# Altium project DEV Board.PrjPCB
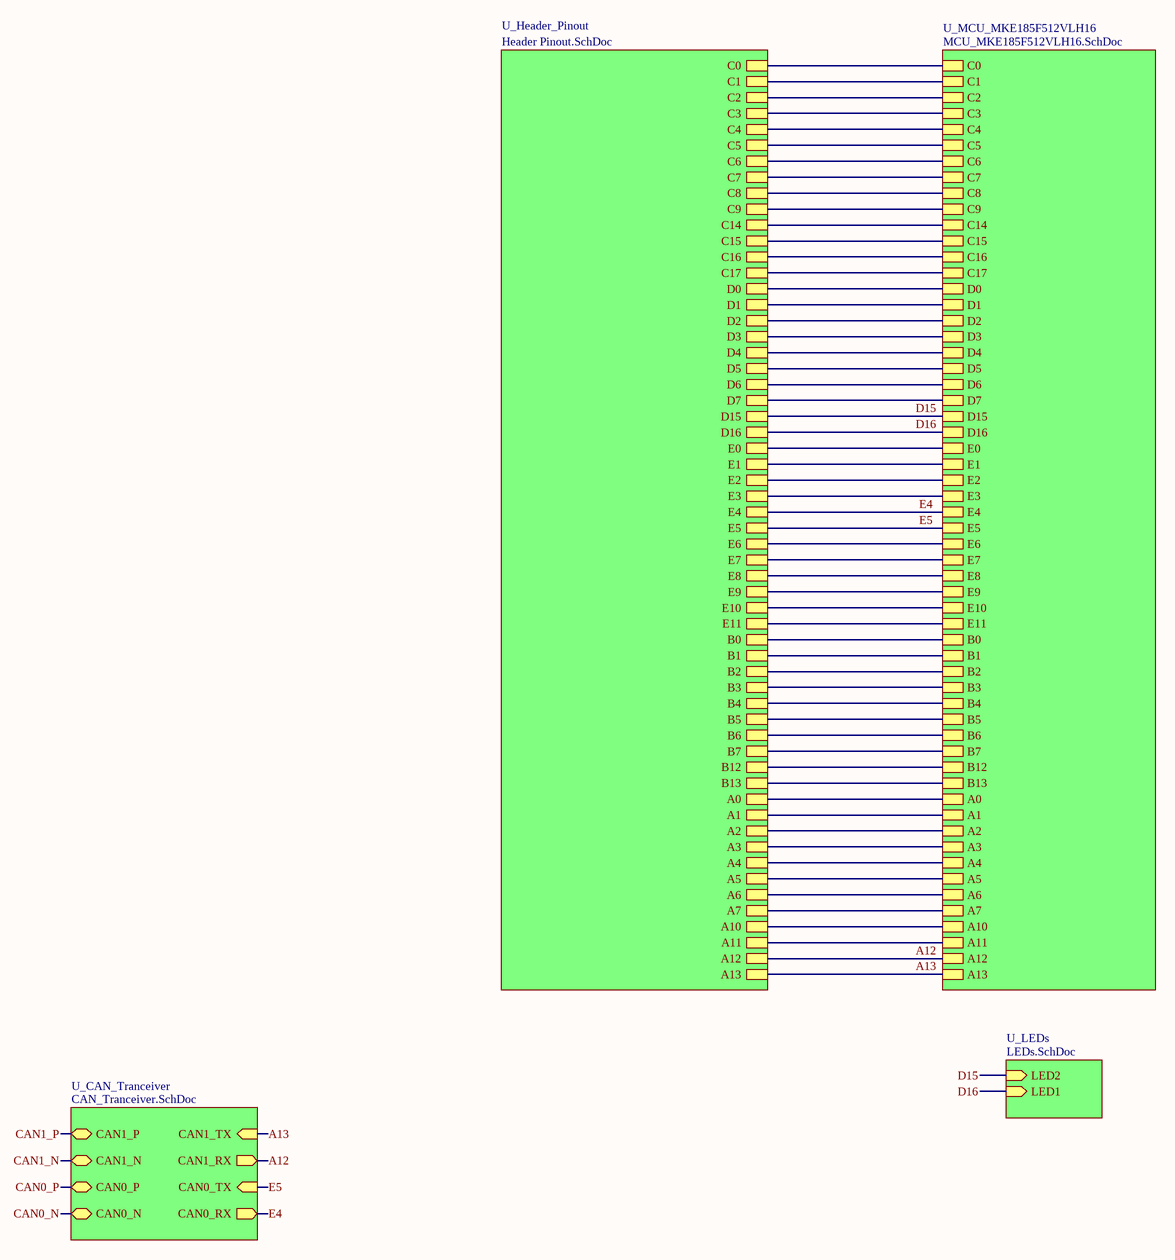
[diagram p0: DEV Board.SchDoc]
5 sheets, 54 parts. Net scope: hierarchical (ports join the sheet entries above them; power ports are global).
Board file: DEV BOARD PCB.PcbDoc
Sheets:
  DEV Board.SchDoc
    U_CAN_Tranceiver = CAN_Tranceiver.SchDoc
    U_LEDs = LEDs.SchDoc
    U_MCU_MKE185F512VLH16 = MCU_MKE185F512VLH16.SchDoc
    U_Header_Pinout = Header Pinout.SchDoc

## Sheet DEV Board.SchDoc
size A3

### Sub-sheets
U_CAN_Tranceiver = CAN_Tranceiver.SchDoc: CAN1_RX (out), CAN1_TX (in), CAN1_P (bidir), CAN1_N (bidir), CAN0_RX (out), CAN0_TX (in), CAN0_P (bidir), CAN0_N (bidir)
U_Header_Pinout = Header Pinout.SchDoc: A13, A12, A11, A10, A7, A6, A5, A4, A3, A2, A1, A0, B13, B12, B7, B6, B5, B4, B3, B2, B1, B0, E11, E10, E9, E8, E7, E6, E5, E4, E3, E2, E1, E0, D16, D15, D7, D6, D5, D4, D3, D2, D1, D0, C17, C16, C15, C14, C9, C8, C7, C6, C5, C4, C3, C2, C1, C0
U_LEDs = LEDs.SchDoc: LED2 (in), LED1 (in)
U_MCU_MKE185F512VLH16 = MCU_MKE185F512VLH16.SchDoc: C0, C1, C2, C3, C6, C7, C8, C9, C14, C15, C16, C17, C4, C5, D0, D1, D2, D3, D4, D5, D6, D7, D15, D16, E0, E1, E2, E3, E4, E5, E6, E7, E8, E9, E10, E11, B0, B1, B2, B3, B4, B5, B6, B7, B12, B13, A4, A5, A10, A0, A1, A2, A3, A6, A7, A11, A12, A13

### Nets
A0: sheet U_MCU_MKE185F512VLH16/A0, sheet U_Header_Pinout/A0
A1: sheet U_MCU_MKE185F512VLH16/A1, sheet U_Header_Pinout/A1
A2: sheet U_MCU_MKE185F512VLH16/A2, sheet U_Header_Pinout/A2
A3: sheet U_MCU_MKE185F512VLH16/A3, sheet U_Header_Pinout/A3
A12: sheet U_CAN_Tranceiver/CAN1_RX, sheet U_MCU_MKE185F512VLH16/A12, sheet U_Header_Pinout/A12
A13: sheet U_CAN_Tranceiver/CAN1_TX, sheet U_MCU_MKE185F512VLH16/A13, sheet U_Header_Pinout/A13
C14: sheet U_MCU_MKE185F512VLH16/C14, sheet U_Header_Pinout/C14
D4: sheet U_MCU_MKE185F512VLH16/D4, sheet U_Header_Pinout/D4
D15: sheet U_LEDs/LED2, sheet U_MCU_MKE185F512VLH16/D15, sheet U_Header_Pinout/D15
D16: sheet U_LEDs/LED1, sheet U_MCU_MKE185F512VLH16/D16, sheet U_Header_Pinout/D16
E4: sheet U_CAN_Tranceiver/CAN0_RX, sheet U_MCU_MKE185F512VLH16/E4, sheet U_Header_Pinout/E4
E5: sheet U_CAN_Tranceiver/CAN0_TX, sheet U_MCU_MKE185F512VLH16/E5, sheet U_Header_Pinout/E5
E11: sheet U_MCU_MKE185F512VLH16/E11, sheet U_Header_Pinout/E11
JTAG_RST: sheet U_MCU_MKE185F512VLH16/A5, sheet U_Header_Pinout/A5
JTAG_TCLK: sheet U_MCU_MKE185F512VLH16/C4, sheet U_Header_Pinout/C4
JTAG_TDI: sheet U_MCU_MKE185F512VLH16/C5, sheet U_Header_Pinout/C5
JTAG_TDO: sheet U_MCU_MKE185F512VLH16/A10, sheet U_Header_Pinout/A10
JTAG_TMS: sheet U_MCU_MKE185F512VLH16/A4, sheet U_Header_Pinout/A4
NetP3_5: sheet U_MCU_MKE185F512VLH16/E10, sheet U_Header_Pinout/E10
NetP3_7: sheet U_MCU_MKE185F512VLH16/D0, sheet U_Header_Pinout/D0
NetP3_8: sheet U_MCU_MKE185F512VLH16/D1, sheet U_Header_Pinout/D1
NetP3_9: sheet U_MCU_MKE185F512VLH16/E9, sheet U_Header_Pinout/E9
NetP3_12: sheet U_MCU_MKE185F512VLH16/E3, sheet U_Header_Pinout/E3
NetP3_13: sheet U_MCU_MKE185F512VLH16/B6, sheet U_Header_Pinout/B6
NetP3_14: sheet U_MCU_MKE185F512VLH16/B7, sheet U_Header_Pinout/B7
NetP4_2: sheet U_MCU_MKE185F512VLH16/E7, sheet U_Header_Pinout/E7
NetP4_3: sheet U_MCU_MKE185F512VLH16/A6, sheet U_Header_Pinout/A6
NetP4_4: sheet U_MCU_MKE185F512VLH16/A7, sheet U_Header_Pinout/A7
NetP4_5: sheet U_MCU_MKE185F512VLH16/C8, sheet U_Header_Pinout/C8
NetP4_6: sheet U_MCU_MKE185F512VLH16/C9, sheet U_Header_Pinout/C9
NetP4_7: sheet U_MCU_MKE185F512VLH16/B0, sheet U_Header_Pinout/B0
NetP4_8: sheet U_MCU_MKE185F512VLH16/B1, sheet U_Header_Pinout/B1
NetP4_11: sheet U_MCU_MKE185F512VLH16/D2, sheet U_Header_Pinout/D2
NetP4_12: sheet U_MCU_MKE185F512VLH16/D3, sheet U_Header_Pinout/D3
NetP4_14: sheet U_MCU_MKE185F512VLH16/B12, sheet U_Header_Pinout/B12
NetP4_15: sheet U_MCU_MKE185F512VLH16/B13, sheet U_Header_Pinout/B13
NetP5_1: sheet U_MCU_MKE185F512VLH16/D5, sheet U_Header_Pinout/D5
NetP5_2: sheet U_MCU_MKE185F512VLH16/D6, sheet U_Header_Pinout/D6
NetP5_3: sheet U_MCU_MKE185F512VLH16/D7, sheet U_Header_Pinout/D7
NetP5_4: sheet U_MCU_MKE185F512VLH16/C2, sheet U_Header_Pinout/C2
NetP5_5: sheet U_MCU_MKE185F512VLH16/C3, sheet U_Header_Pinout/C3
NetP5_6: sheet U_MCU_MKE185F512VLH16/B4, sheet U_Header_Pinout/B4
NetP5_7: sheet U_MCU_MKE185F512VLH16/B5, sheet U_Header_Pinout/B5
NetP5_8: sheet U_MCU_MKE185F512VLH16/E8, sheet U_Header_Pinout/E8
NetP5_9: sheet U_MCU_MKE185F512VLH16/B2, sheet U_Header_Pinout/B2
NetP5_10: sheet U_MCU_MKE185F512VLH16/B3, sheet U_Header_Pinout/B3
NetP5_12: sheet U_MCU_MKE185F512VLH16/C15, sheet U_Header_Pinout/C15
NetP5_13: sheet U_MCU_MKE185F512VLH16/C16, sheet U_Header_Pinout/C16
NetP5_14: sheet U_MCU_MKE185F512VLH16/C17, sheet U_Header_Pinout/C17
NetP5_15: sheet U_MCU_MKE185F512VLH16/C0, sheet U_Header_Pinout/C0
NetP5_16: sheet U_MCU_MKE185F512VLH16/C1, sheet U_Header_Pinout/C1
NetP6_3: sheet U_MCU_MKE185F512VLH16/E2, sheet U_Header_Pinout/E2
NetP6_4: sheet U_MCU_MKE185F512VLH16/E6, sheet U_Header_Pinout/E6
NetP6_5: sheet U_MCU_MKE185F512VLH16/C6, sheet U_Header_Pinout/C6
NetP6_6: sheet U_MCU_MKE185F512VLH16/C7, sheet U_Header_Pinout/C7
NetP6_13: sheet U_MCU_MKE185F512VLH16/E0, sheet U_Header_Pinout/E0
NetP6_14: sheet U_MCU_MKE185F512VLH16/E1, sheet U_Header_Pinout/E1
NetP6_16: sheet U_MCU_MKE185F512VLH16/A11, sheet U_Header_Pinout/A11

## Sheet CAN_Tranceiver.SchDoc
size A
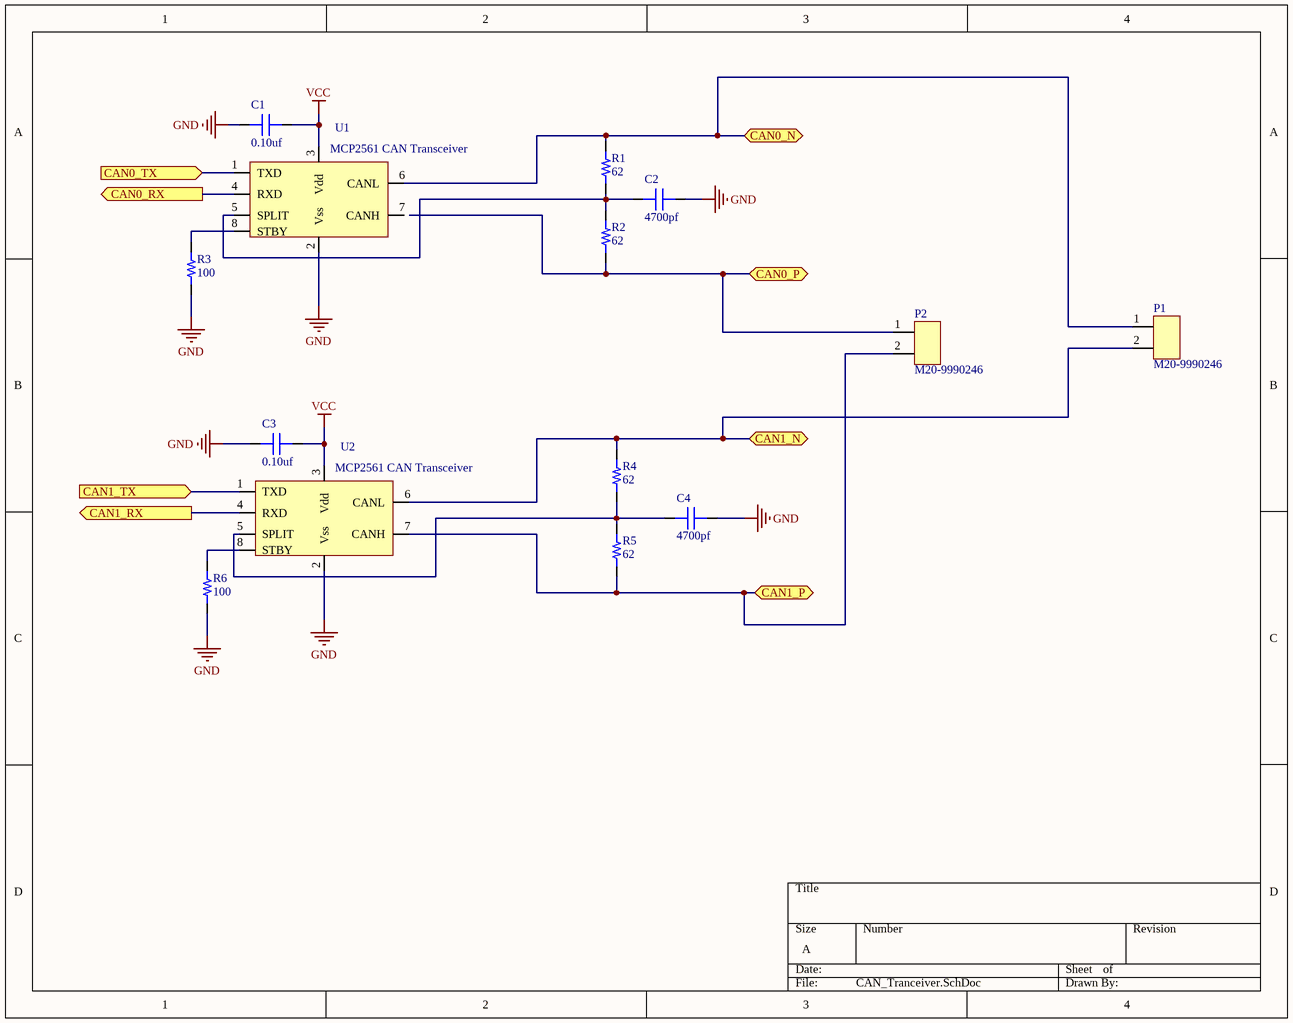
[diagram p1: CAN_Tranceiver.SchDoc]

### Parts
C1  value 0.10uf  [CAP 0603/1608]  (hidden comment: Capacitor MLCC 0.10uf 50V CAP 0603/1608)
C2  value 4700pf  [CAP 0603/1608]  (hidden comment: Capacitor MLCC 4700pf 50V CAP 0603/1608)
C3  value 0.10uf  [CAP 0603/1608]  (hidden comment: Capacitor MLCC 0.10uf 50V CAP 0603/1608)
C4  value 4700pf  [CAP 0603/1608]  (hidden comment: Capacitor MLCC 4700pf 50V CAP 0603/1608)
P1  M20-9990246  [M20-9990246]
P2  M20-9990246  [M20-9990246]
R1  value 62  [RES 0603/1608]  (hidden comment: Resistor 62 0603 1/10W 5%)
R2  value 62  [RES 0603/1608]  (hidden comment: Resistor 62 0603 1/10W 5%)
R3  value 100  [RES 0603/1608]  (hidden comment: Resistor 100 0603 1/10W 10%)
R4  value 62  [RES 0603/1608]  (hidden comment: Resistor 62 0603 1/10W 5%)
R5  value 62  [RES 0603/1608]  (hidden comment: Resistor 62 0603 1/10W 5%)
R6  value 100  [RES 0603/1608]  (hidden comment: Resistor 100 0603 1/10W 10%)
U1  MCP2561 CAN Transceiver  [SOIC-8]
U2  MCP2561 CAN Transceiver  [SOIC-8]

### Ports
CAN0_N (bidir), CAN0_P (bidir), CAN0_RX (out), CAN0_TX (in), CAN1_N (bidir), CAN1_P (bidir), CAN1_RX (out), CAN1_TX (in)

### Nets
GND: C1.1 C2.1 C3.1 C4.1 R3.1 R6.1 U1.2(Vss) U2.2(Vss)
VCC: C1.2 C3.2 U1.3(Vdd) U2.3(Vdd)
A12: U2.4(RXD) ; port CAN1_RX
A13: U2.1(TXD) ; port CAN1_TX
CAN0_N: P1.1 R1.1 U1.6(CANL) ; port CAN0_N
CAN0_P: P2.1 R2.2 ; port CAN0_P
CAN1_N: P1.2 R4.1 U2.6(CANL) ; port CAN1_N
CAN1_P: P2.2 R5.2 U2.7(CANH) ; port CAN1_P
E4: U1.4(RXD) ; port CAN0_RX
E5: U1.1(TXD) ; port CAN0_TX
NetC2_2: C2.2 R1.2 R2.1 U1.5(SPLIT)
NetC4_2: C4.2 R4.2 R5.1 U2.5(SPLIT)
NetR3_2: R3.2 U1.8(STBY)
NetR6_2: R6.2 U2.8(STBY)

Not connected (* = marked no-connect by the designer): U1 7(CANH)

### Library data of the parts
C1 C3 = 943: Manufacturer_id: 1; idCapacitor: 943; Name: Cap_0.10uf_50V_CAP 0603/1608; Dielectric: Ceramic; Created_By: Nick Mah; Drawer_id: 1; Voltage_Rating: 50V; Package: CAP 0603/1608; Created_Date: 10/20/2018
C2 C4 = 929: Manufacturer_id: 1; idCapacitor: 929; Name: Cap_4700pf_50V_CAP 0603/1608; Dielectric: Ceramic; Created_By: Nick Mah; Drawer_id: 1; Voltage_Rating: 50V; Package: CAP 0603/1608; Created_Date: 10/20/2018
P1 P2 = 25: 2 Pin VCC Power Header, Male; Manufacturer_id: 1; idConn: 25; Value: CONN; Voltage_Rating: Null; Num_Contacts: 2; Pitch: 2.54; Created_By: Austin; Drawer_id: 1; Name: M20-9990246; Num_Rows: Null; Package: Conn; MfrPartNo: M20-9990246; Link: https://www.digikey.com/product-detail/en/harwin-inc/M20-9990246/952-2262-ND/3728226; ComponentLink1Description: Null; ComponentLink1URL: https://www.digikey.com/product-detail/en/harwin-inc/M20-9990246/952-2262-ND/3728226; Supplier1: Digi-Key; Supplier1PartNo: 952-2262-ND; Created_Date: 12/15/2018; Updated_By: Null
R1 R2 R4 R5 = 1340: Manufacturer_id: 1; idResistor: 1340; Name: Res_62_0603_1/10W_5%; Created_By: Nick Mah; Supplier 1: Digi-Key; Drawer_id: 1; Tolerance: 5%; Power: 1/10W; Package: 0603; ComponentLink1Description: Datasheet; Created_Date: 2018-10-20
R3 R6 = 2293: Manufacturer_id: 1; idResistor: 2293; Name: Res_100_0603_1/10W_10%; Created_By: Nick Mah; Supplier 1: Digi-Key; Drawer_id: 1; Tolerance: 10%; Power: 1/10W; Package: 0603; ComponentLink1Description: Datasheet; Created_Date: 2018-10-20
U1 U2 = 5: Manufacturer_id: 1; idIC_Interface: 5; Value: CAN/UART; Data_Rate: 1Mbps; Vin(Min): 4.5V; Vin(Max): 5.5V; Created_By: Angel Delgado; Drawer_id: 1; Name: CAN Transceiver; Type: Transceiver; Protocol: CAN; Num_Circuits: 1; Package: SOIC-8; MfrPartNo: MCP2561; Link: https://www.digikey.com/product-detail/en/microchip-technology/MCP2561T-E-SN/MCP2561T-E-SNCT-ND/5148846

## Sheet LEDs.SchDoc
size A
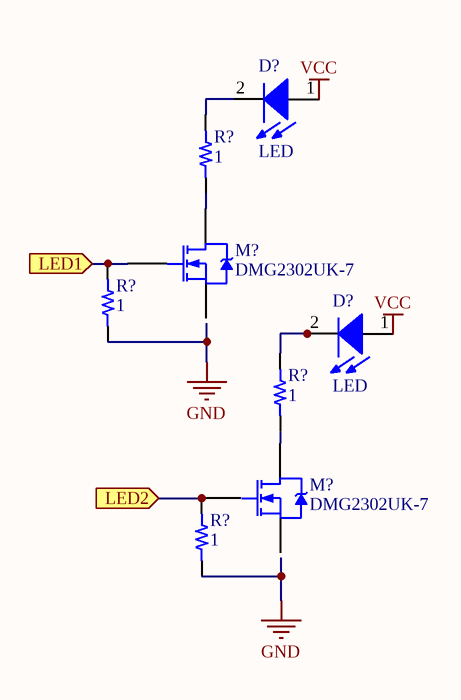
[diagram p2: LEDs.SchDoc]

### Parts
(Parts that share a designator on the sheet are numbered #1, #2 ... from top to bottom, then left to right.)
D?#1  LED  [0805_LED]
D?#2  LED  [0805_LED]
M?#1  DMG2302UK-7  [SOT23-3]
M?#2  DMG2302UK-7  [SOT23-3]
R?#1  1  [RES 0603/1608]
R?#2  resistance: 1  [0603]  (hidden comment: resistor)
R?#3  1  [RES 0603/1608]
R?#4  resistance: 1  [0603]  (hidden comment: resistor)

### Ports
LED1 (in), LED2 (in)

### Nets
GND: R?#2.1 R?#4.1
VCC: D?#1.1(A) D?#2.1(A)
D15: M?#2.1(G) R?#4.2 ; port LED2
D16: M?#1.1(G) R?#2.2 ; port LED1
NetD?#1_2: D?#1.2(K) R?#1.2
NetD?#2_2: D?#2.2(K) R?#3.2
NetM?#1_3: M?#1.3(D) R?#1.1
NetM?#2_3: M?#2.3(D) R?#3.1

Not connected (* = marked no-connect by the designer): M?#1 2(S); M?#2 2(S)

### Library data of the parts
D?#1 D?#2 = 1: idLED: 1; Name: LED_0805_RED; Value: Red; Vf: 0.7V; Manufacturer_id: 1; Drawer_id: 1; Package: 0805
M?#1 M?#2 = 6: MOSFET N-CHANNEL 30V 5A SOT23; Manufacturer_id: 1; idFETs: 6; Value: N_Channel; Vdss: 20V; Id: 2.8A; Rds_On: 90mOhm; Vgs(typ): 800mV; Vgs(Max): 1V; Created_By: Angel; MfrPartNo: DMG2302UK-7; Drawer_id: 1; Name: DMG2302UK-7; Num_Circuits: 1; Package: SOT-23; Link: https://www.digikey.com/product-detail/en/diodes-incorporated/DMG2302UK-7/DMG2302UK-7DICT-ND/6010163; Supplier1: Digi-Key
R?#1-R?#4 = 1: name: 0603 Resistor; percent tolerance: 5; id: 1; package: 0603; quantity: 0
  R?#1 R?#3: resistance: 1

## Sheet MCU_MKE185F512VLH16.SchDoc: Microcontroller
size A3; DrawnBy: Alvin Ha; DocumentNumber: MCU2018-2; Revision: 2.0; SheetNumber: 2; SheetTotal: 4
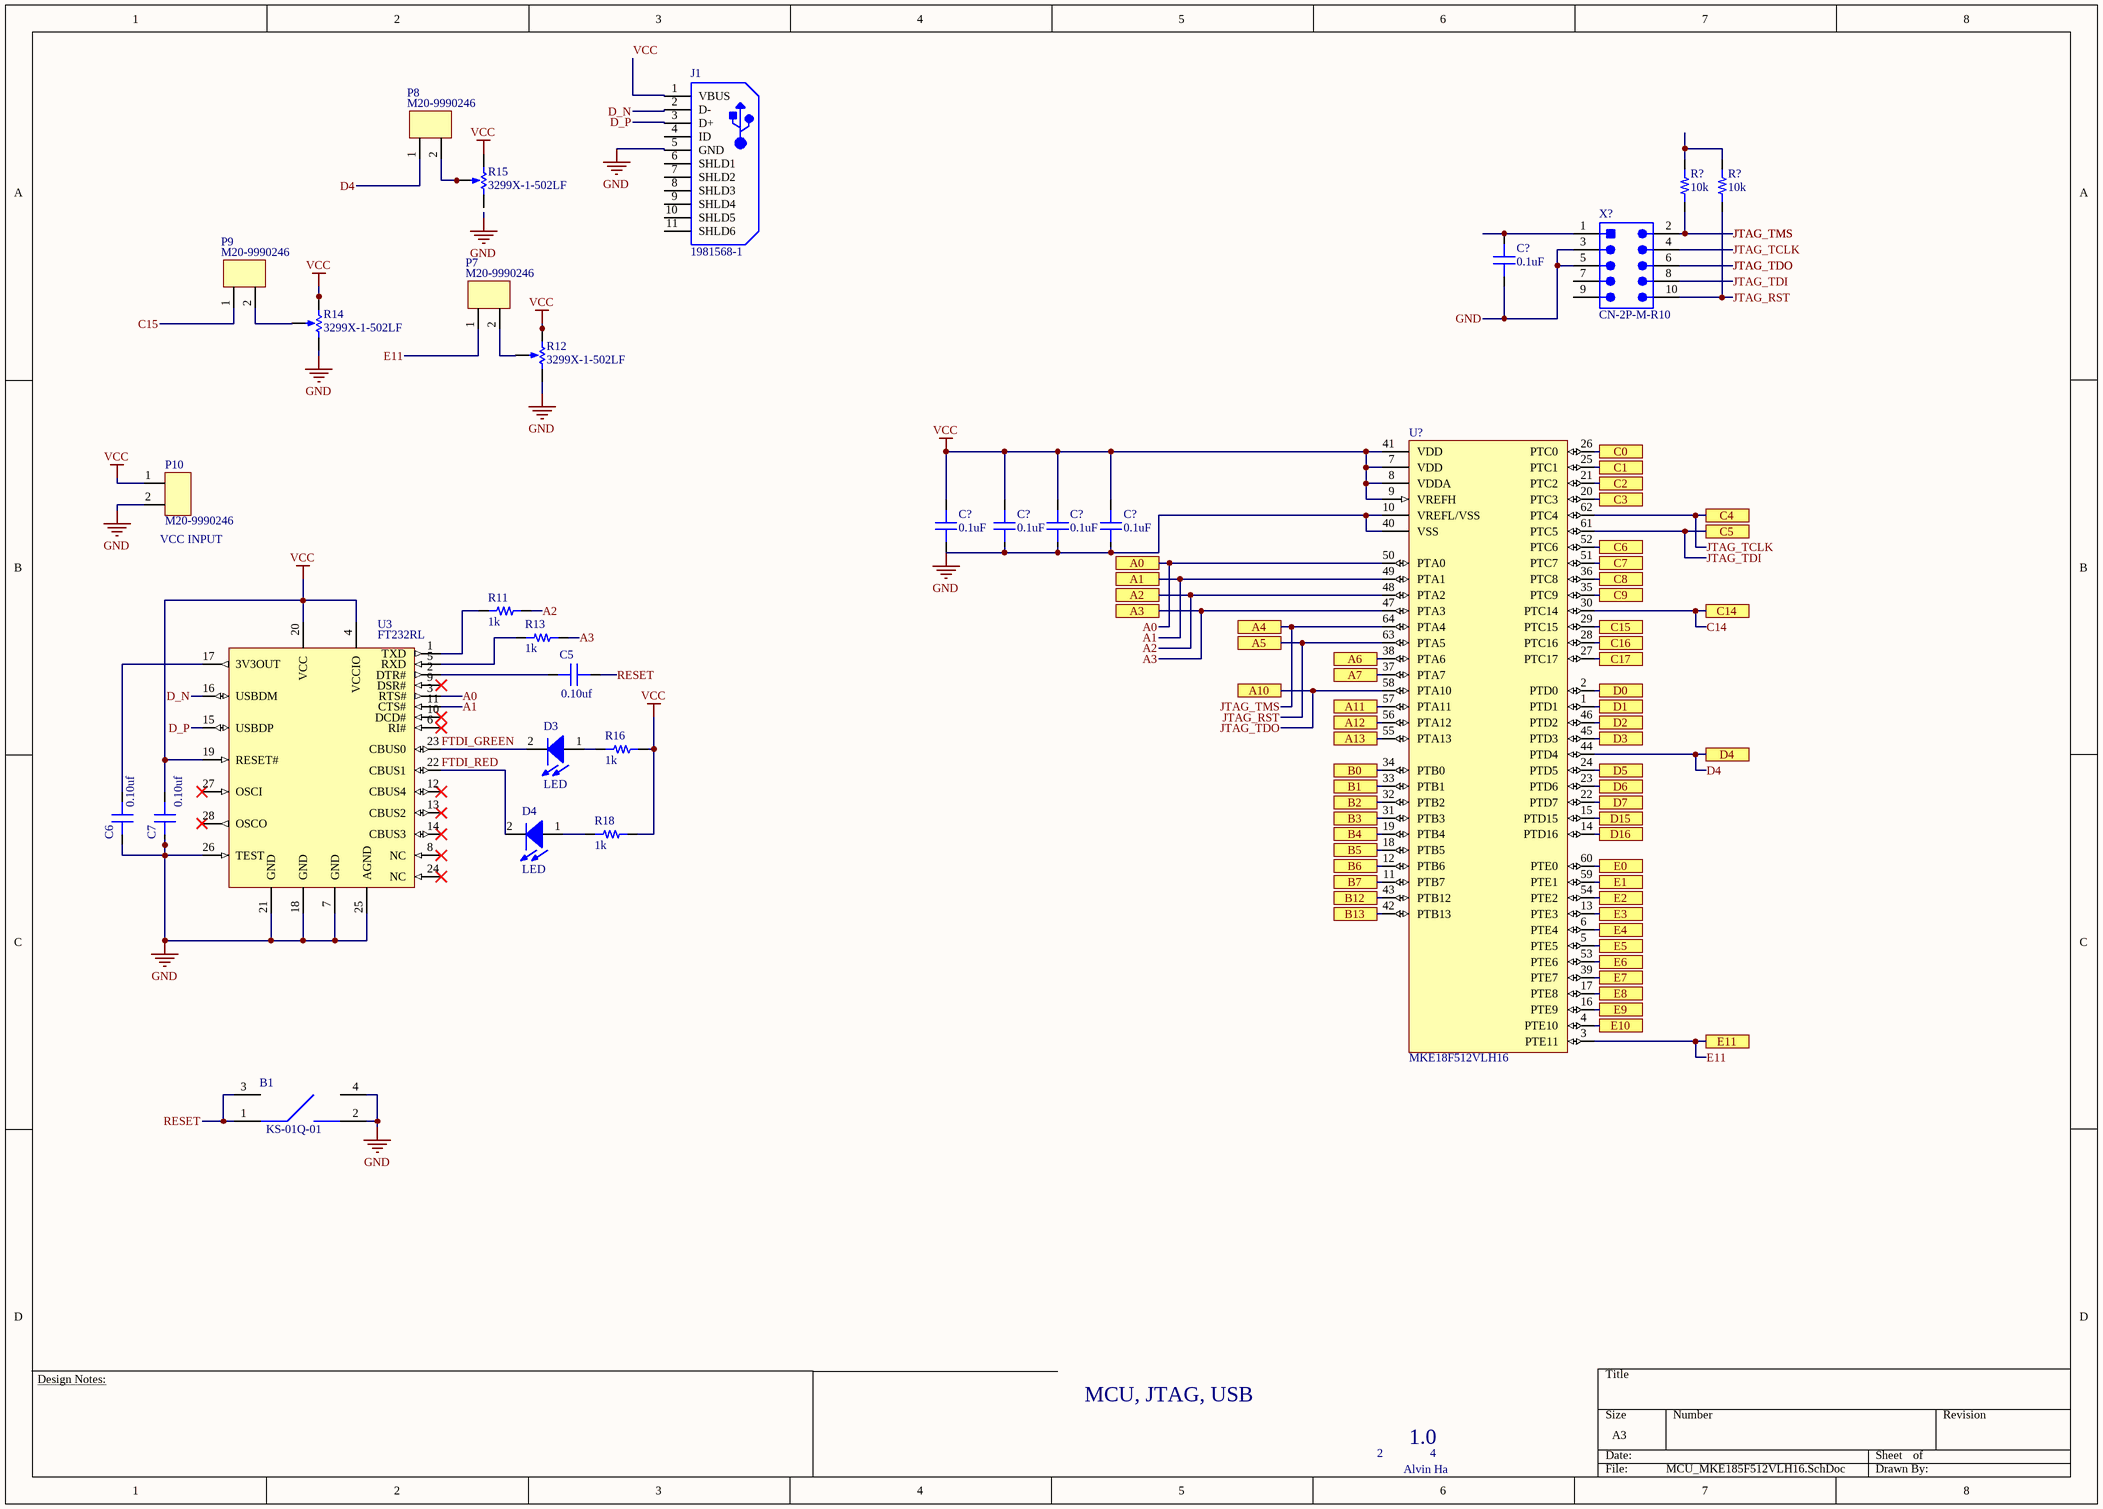
[diagram p3: MCU_MKE185F512VLH16.SchDoc]

### Parts
(Parts that share a designator on the sheet are numbered #1, #2 ... from top to bottom, then left to right.)
B1  KS-01Q-01  [KS-01Q-01]
C5  value 0.10uf  [CAP 0603/1608]  (hidden comment: Capacitor MLCC 0.10uf 25V CAP 0603/1608)
C6  value 0.10uf  [CAP 0603/1608]  (hidden comment: Capacitor MLCC 0.10uf 25V CAP 0603/1608)
C7  value 0.10uf  [CAP 0603/1608]  (hidden comment: Capacitor MLCC 0.10uf 25V CAP 0603/1608)
C?#1  capacitance: 0.1uF  [0603]  (hidden comment: capacitor)
C?#2  capacitance: 0.1uF  [0603]  (hidden comment: capacitor)
C?#3  capacitance: 0.1uF  [0603]  (hidden comment: capacitor)
C?#4  capacitance: 0.1uF  [0603]  (hidden comment: capacitor)
C?#5  capacitance: 0.1uF  [0603]  (hidden comment: capacitor)
D3  LED  [0805_LED]
D4  LED  [0805_LED]
J1  1981568-1  [TECO-1981568-5_V]
P7  M20-9990246  [M20-9990246]
P8  M20-9990246  [M20-9990246]
P9  M20-9990246  [M20-9990246]
P10  M20-9990246  [M20-9990246]
R11  1k  [RES 0603/1608]
R12  3299X-1-502LF  [3299X-1-502LF]
R13  1k  [RES 0603/1608]
R14  3299X-1-502LF  [3299X-1-502LF]
R15  3299X-1-502LF  [3299X-1-502LF]
R16  1k  [RES 0603/1608]
R18  1k  [RES 0603/1608]
R?#5  resistance: 10k  [0603]  (hidden comment: resistor)
R?#6  resistance: 10k  [0603]  (hidden comment: resistor)
U3  FT232RL  [SSOP-28]
U?  MKE18F512VLH16  [TQFP64]
X?  CN-2P-M-R10  [HDR2X5_SMT]

### Ports
A0, A1, A2, A3, A4, A5, A6, A7, A10, A11, A12, A13, B0, B1, B2, B3, B4, B5, B6, B7, B12, B13, C0, C1, C2, C3, C4, C5, C6, C7, C8, C9, C14, C15, C16, C17, D0, D1, D2, D3, D4, D5, D6, D7, D15, D16, E0, E1, E2, E3, E4, E5, E6, E7, E8, E9, E10, E11

### Nets
GND: B1.2 B1.4 C6.1 C7.1 C?#1.1 C?#2.1 C?#3.1 C?#4.1 C?#5.1 J1.5(GND) P10.2 R12.3(BOT) R14.3(BOT) U3.7(GND) U3.18(GND) U3.21(GND) U3.25(AGND) U3.26(TEST) U?.10(VREFL/VSS) U?.40(VSS) X?.3 X?.5
VCC: C7.2 C?#2.2 C?#3.2 C?#4.2 C?#5.2 J1.1(VBUS) P10.1 R12.1(TOP) R14.1(TOP) R15.1(TOP) R16.2 R18.2 U3.4(VCCIO) U3.19(RESET#) U3.20(VCC) U?.7(VDD) U?.8(VDDA) U?.9(VREFH) U?.41(VDD)
A0: U3.3(RTS#) U?.50(PTA0) ; port A0
A1: U3.11(CTS#) U?.49(PTA1) ; port A1
A2: R11.2 U?.48(PTA2) ; port A2
A3: R13.2 U?.47(PTA3) ; port A3
A12: U?.56(PTA12) ; port A12
A13: U?.55(PTA13) ; port A13
C14: U?.30(PTC14) ; port C14
C15: P9.1
D4: P8.1 U?.44(PTD4) ; port D4
D15: U?.15(PTD15) ; port D15
D16: U?.14(PTD16) ; port D16
D_N: J1.2(D-) U3.16(USBDM)
D_P: J1.3(D+) U3.15(USBDP)
E4: U?.6(PTE4) ; port E4
E5: U?.5(PTE5) ; port E5
E11: P7.1 U?.3(PTE11) ; port E11
FTDI_GREEN: D3.2(K) U3.23(CBUS0)
FTDI_RED: D4.2(K) U3.22(CBUS1)
JTAG_RST: R?#6.1 U?.63(PTA5) X?.10 ; port A5
JTAG_TCLK: U?.62(PTC4) X?.4 ; port C4
JTAG_TDI: U?.61(PTC5) X?.8 ; port C5
JTAG_TDO: U?.58(PTA10) X?.6 ; port A10
JTAG_TMS: R?#5.1 U?.64(PTA4) X?.2 ; port A4
RESET: B1.1 B1.3 C5.2
NetC5_1: C5.1 U3.2(DTR#)
NetC6_2: C6.2 U3.17(3V3OUT)
NetC?#1_2: C?#1.2 X?.1
NetD3_1: D3.1(A) R16.1
NetD4_1: D4.1(A) R18.1
NetP3_5: U?.4(PTE10) ; port E10
NetP3_7: U?.2(PTD0) ; port D0
NetP3_8: U?.1(PTD1) ; port D1
NetP3_9: U?.16(PTE9) ; port E9
NetP3_12: U?.13(PTE3) ; port E3
NetP3_13: U?.12(PTB6) ; port B6
NetP3_14: U?.11(PTB7) ; port B7
NetP4_2: U?.39(PTE7) ; port E7
NetP4_3: U?.38(PTA6) ; port A6
NetP4_4: U?.37(PTA7) ; port A7
NetP4_5: U?.36(PTC8) ; port C8
NetP4_6: U?.35(PTC9) ; port C9
NetP4_7: U?.34(PTB0) ; port B0
NetP4_8: U?.33(PTB1) ; port B1
NetP4_11: U?.46(PTD2) ; port D2
NetP4_12: U?.45(PTD3) ; port D3
NetP4_14: U?.43(PTB12) ; port B12
NetP4_15: U?.42(PTB13) ; port B13
NetP5_1: U?.24(PTD5) ; port D5
NetP5_2: U?.23(PTD6) ; port D6
NetP5_3: U?.22(PTD7) ; port D7
NetP5_4: U?.21(PTC2) ; port C2
NetP5_5: U?.20(PTC3) ; port C3
NetP5_6: U?.19(PTB4) ; port B4
NetP5_7: U?.18(PTB5) ; port B5
NetP5_8: U?.17(PTE8) ; port E8
NetP5_9: U?.32(PTB2) ; port B2
NetP5_10: U?.31(PTB3) ; port B3
NetP5_12: U?.29(PTC15) ; port C15
NetP5_13: U?.28(PTC16) ; port C16
NetP5_14: U?.27(PTC17) ; port C17
NetP5_15: U?.26(PTC0) ; port C0
NetP5_16: U?.25(PTC1) ; port C1
NetP6_3: U?.54(PTE2) ; port E2
NetP6_4: U?.53(PTE6) ; port E6
NetP6_5: U?.52(PTC6) ; port C6
NetP6_6: U?.51(PTC7) ; port C7
NetP6_13: U?.60(PTE0) ; port E0
NetP6_14: U?.59(PTE1) ; port E1
NetP6_16: U?.57(PTA11) ; port A11
NetP8_2: P8.2 R15.2(TAP)
NetR11_1: R11.1 U3.1(TXD)
NetR13_1: R13.1 U3.5(RXD)
NetR?#5_2: R?#5.2 R?#6.2

Not connected (* = marked no-connect by the designer): J1 4(ID) 6(SHLD1) 7(SHLD2) 8(SHLD3) 9(SHLD4) 10(SHLD5) 11(SHLD6); P7 2; P9 2; R12 2(TAP); R14 2(TAP); R15 3(BOT); U3 6(RI#)* 8(NC)* 9(DSR#)* 10(DCD#)* 12(CBUS4)* 13(CBUS2)* 14(CBUS3)* 24(NC)* 27(OSCI)* 28(OSCO)*; X? 7 9

### Notes on the sheet
- (near P10) VCC INPUT
- MCU, JTAG, USB
- 1.0
- Design Notes:

### Library data of the parts
B1 = 7: RESET button; Manufacturer_id: 1; idTable: 7; Value: NULL; Num_Contacts: 4; Num_Rows: 2; Pitch: 5; Created_By: Austin; Drawer_id: 1; Name: KS-01Q-01; Voltage_Rating: Null; Package: NULL; MfrPartNo: KS-01Q-01; Link: https://www.digikey.com/product-detail/en/e-switch/KS-01Q-01/EG4791-ND/2116270; ComponentLink1Description: null; ComponentLink1URL: Null; Supplier1: e-switch; Supplier1PartNo: EG4791-ND; Created_Date: 12/15/2018; Updated_By: Null
C5-C7 = 583: Manufacturer_id: 1; idCapacitor: 583; Name: Cap_0.10uf_25V_CAP 0603/1608; Dielectric: Ceramic; Created_By: Nick Mah; Drawer_id: 1; Voltage_Rating: 25V; Package: CAP 0603/1608; Created_Date: 10/20/2018
C?#1-C?#5 = 1: Generic 0603 capacitor; id: 1; voltage: 50; dielectric: Ceramic; percent tolerance: 10; Name: 0603 Capacitor; ESR: 1; package: 0603; quantity: 0
D3 = 2: Manufacturer_id: 1; idLED: 2; Name: CMD17_0805_GREEN; Value: Green; Brightness: 7mcd; Id: 20mA; Vf: 2.1V; Drawer_id: 1; Link: https://www.digikey.com/product-detail/en/visual-communications-company-vcc/CMD17-21VGD-TR8/L62505CT-ND/254936; Package: 0805
D4 = 1: as D?#1 on sheet LEDs; Manufacturer_id: 1; Drawer_id: 1; Package: 0805
J1 = 5: USB Micro Type B; Manufacturer_id: 1; idConn: 5; Name: TE USB Micro; Value: CONN; Created_By: Aiku; MfrPartNo: 1981568-1; Drawer_id: 1; Num_Contacts: 5; Link: https://www.mouser.com/ProductDetail/TE-Connectivity-AMP/1981568-1?qs=sGAEpiMZZMulM8LPOQ%252bykzEIUPbUCiSfqsfxH3Oq%252bYo%3d; ComponentLink1Description: Datasheet; Supplier1: TE; Created_Date: 10/20/2018
P7-P10 = 25: as P1 on sheet CAN_Tranceiver; Drawer_id: 1; Name: M20-9990246; Num_Rows: Null; Package: Conn; MfrPartNo: M20-9990246; Link: https://www.digikey.com/product-detail/en/harwin-inc/M20-9990246/952-2262-ND/3728226; ComponentLink1Description: Null; ComponentLink1URL: https://www.digikey.com/product-detail/en/harwin-inc/M20-9990246/952-2262-ND/3728226; Supplier1: Digi-Key; Supplier1PartNo: 952-2262-ND; Created_Date: 12/15/2018; Updated_By: Null
R11 R13 R16 R18 = 1: id: 1; name: 0603 Resistor; percent tolerance: 5; resistance: 1k; package: 0603; quantity: 0
R12 R14 R15 = 6: Manufacturer_id: 1; idTable: 6; Value: 5K; Num_Contacts: 3; Pitch: 2.54mm; Drawer_id: 1; Name: 3299X-1-502LF; MfrPartNo: 3299X-1-502LF; Link: https://www.digikey.com/product-detail/en/bourns-inc/3299X-1-502LF/3299X-502LF-ND/1088167; ComponentLink1Description: Datasheet
R?#5 R?#6 = 1: id: 1; Name: 0603 Resistor; percent tolerance: 5; package: 0603; quantity: 0
U3 = 3: Manufacturer_id: 1; idIC_Interface: 3; Name: USB FTDI; Protocol: UART; Vin(Min): 3.3; Vin(Max): 5.25; Created_By: Kyle; Drawer_id: 1; MfrPartNo: FT232RL; Link: https://www.digikey.com/product-detail/en/ftdi-future-technology-devices-international-ltd/FT232RL-REEL/768-1007-1-ND/1836402
U? = 1: 32b NXP Microcontroller; id: 1; voltagemin: 2.70000004768372; voltagemax: 5.5; name: MKE18F512VLH16; package: TQFP64; quantity: 0
X? = 4: CONN_TE_2X5POS; id: 4; Name: 5103309-1; numcontacts: 10; numrows: 2; pitch: 2.54mm; MfrPartNo: *; link: https://www.digikey.com/product-detail/en/5103309-1/A33160-ND/1114898?utm_campaign=buynow&WT.z_cid=ref_octopart_dkc_buynow&utm_medium=aggregator&curr=usd&site=us&utm_source=octopart; quantity: 0

## Sheet Header Pinout.SchDoc
size A
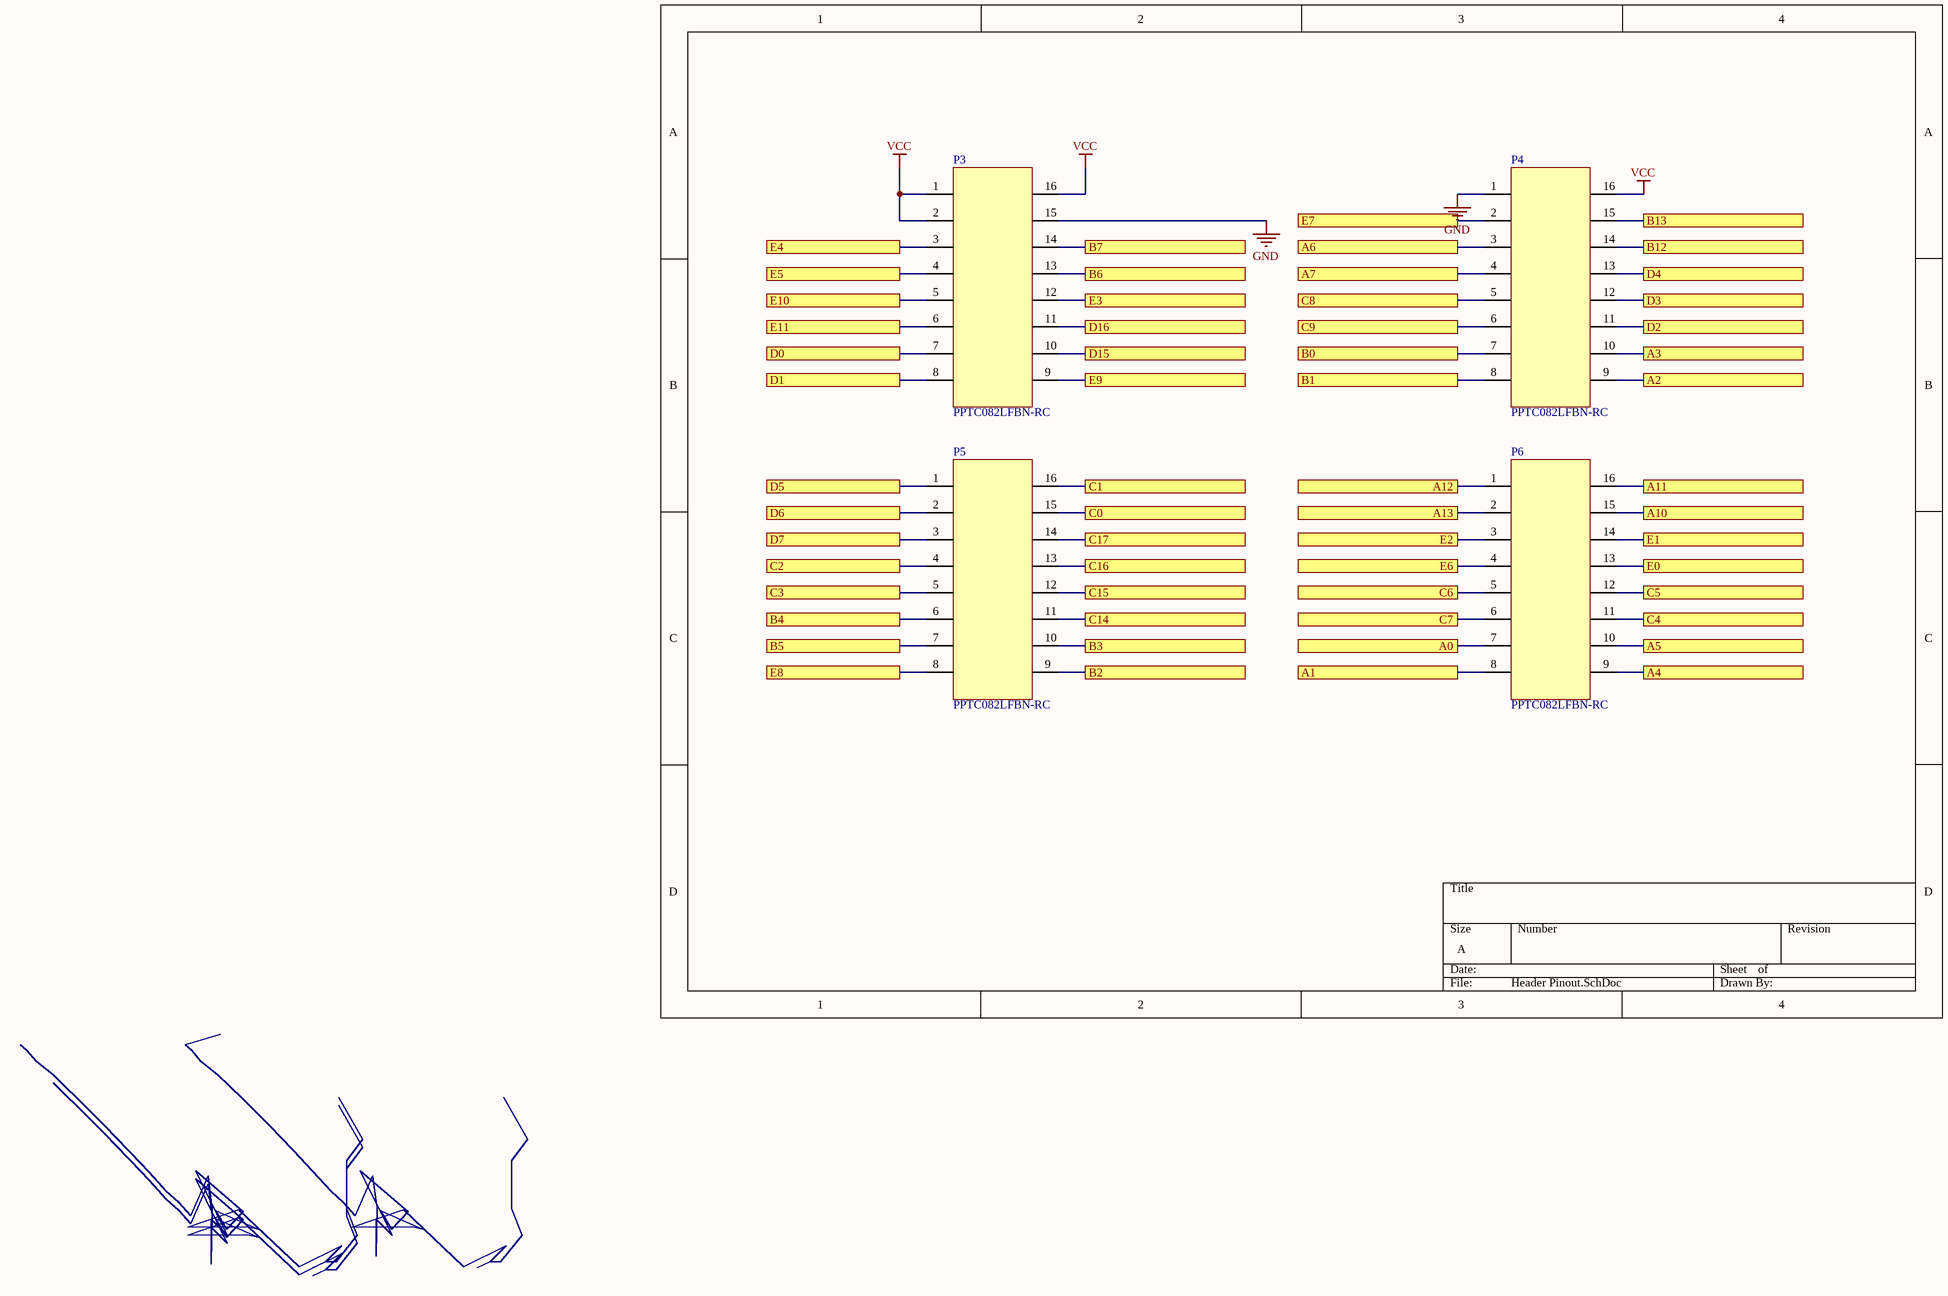
[diagram p4: Header Pinout.SchDoc]

### Parts
P3  PPTC082LFBN-RC  [PPTC082LFBN-RC]
P4  PPTC082LFBN-RC  [PPTC082LFBN-RC]
P5  PPTC082LFBN-RC  [PPTC082LFBN-RC]
P6  PPTC082LFBN-RC  [PPTC082LFBN-RC]

### Ports
A0, A1, A2, A3, A4, A5, A6, A7, A10, A11, A12, A13, B0, B1, B2, B3, B4, B5, B6, B7, B12, B13, C0, C1, C2, C3, C4, C5, C6, C7, C8, C9, C14, C15, C16, C17, D0, D1, D2, D3, D4, D5, D6, D7, D15, D16, E0, E1, E2, E3, E4, E5, E6, E7, E8, E9, E10, E11

### Nets
GND: P3.15 P4.1
VCC: P3.1 P3.2 P3.16 P4.16
A0: P6.7 ; port A0
A1: P6.8 ; port A1
A2: P4.9 ; port A2
A3: P4.10 ; port A3
A12: P6.1 ; port A12
A13: P6.2 ; port A13
C14: P5.11 ; port C14
D4: P4.13 ; port D4
D15: P3.10 ; port D15
D16: P3.11 ; port D16
E4: P3.3 ; port E4
E5: P3.4 ; port E5
E11: P3.6 ; port E11
JTAG_RST: P6.10 ; port A5
JTAG_TCLK: P6.11 ; port C4
JTAG_TDI: P6.12 ; port C5
JTAG_TDO: P6.15 ; port A10
JTAG_TMS: P6.9 ; port A4
NetP3_5: P3.5 ; port E10
NetP3_7: P3.7 ; port D0
NetP3_8: P3.8 ; port D1
NetP3_9: P3.9 ; port E9
NetP3_12: P3.12 ; port E3
NetP3_13: P3.13 ; port B6
NetP3_14: P3.14 ; port B7
NetP4_2: P4.2 ; port E7
NetP4_3: P4.3 ; port A6
NetP4_4: P4.4 ; port A7
NetP4_5: P4.5 ; port C8
NetP4_6: P4.6 ; port C9
NetP4_7: P4.7 ; port B0
NetP4_8: P4.8 ; port B1
NetP4_11: P4.11 ; port D2
NetP4_12: P4.12 ; port D3
NetP4_14: P4.14 ; port B12
NetP4_15: P4.15 ; port B13
NetP5_1: P5.1 ; port D5
NetP5_2: P5.2 ; port D6
NetP5_3: P5.3 ; port D7
NetP5_4: P5.4 ; port C2
NetP5_5: P5.5 ; port C3
NetP5_6: P5.6 ; port B4
NetP5_7: P5.7 ; port B5
NetP5_8: P5.8 ; port E8
NetP5_9: P5.9 ; port B2
NetP5_10: P5.10 ; port B3
NetP5_12: P5.12 ; port C15
NetP5_13: P5.13 ; port C16
NetP5_14: P5.14 ; port C17
NetP5_15: P5.15 ; port C0
NetP5_16: P5.16 ; port C1
NetP6_3: P6.3 ; port E2
NetP6_4: P6.4 ; port E6
NetP6_5: P6.5 ; port C6
NetP6_6: P6.6 ; port C7
NetP6_13: P6.13 ; port E0
NetP6_14: P6.14 ; port E1
NetP6_16: P6.16 ; port A11

### Library data of the parts
P3-P6 = 23: 2x8 female header; Manufacturer_id: 1; idConn: 23; Value: CONN; Voltage_Rating: V; Num_Contacts: 16; Num_Rows: 2; Pitch: 2.54; Created_By: Austin; Updated_By: Null; Drawer_id: 1; Name: PPTC082LFBN-RC; Package: Conn; MfrPartNo: PPTC082LFBN-RC; Link: https://www.digikey.com/product-detail/en/sullins-connector-solutions/PPTC082LFBN-RC/S7076-ND/810214; ComponentLink1Description: Null; ComponentLink1URL: Null; Supplier1: Digi-Key; Supplier1PartNo: S7076-ND; Created_Date: 12/15/2018

## Nets that join several sheets
GND: CAN_Tranceiver (8 pins), LEDs (R?#2.1 R?#4.1), MCU_MKE185F512VLH16 (22 pins), Header Pinout (P3.15 P4.1)
VCC: CAN_Tranceiver (C1.2 C3.2 U1.3 U2.3), LEDs (D?#1.1 D?#2.1), MCU_MKE185F512VLH16 (19 pins), Header Pinout (P3.1 P3.2 P3.16 P4.16)
A0: MCU_MKE185F512VLH16 (U3.3 U?.50), Header Pinout (P6.7)
A1: MCU_MKE185F512VLH16 (U3.11 U?.49), Header Pinout (P6.8)
A2: MCU_MKE185F512VLH16 (R11.2 U?.48), Header Pinout (P4.9)
A3: MCU_MKE185F512VLH16 (R13.2 U?.47), Header Pinout (P4.10)
A12: CAN_Tranceiver (U2.4), MCU_MKE185F512VLH16 (U?.56), Header Pinout (P6.1)
A13: CAN_Tranceiver (U2.1), MCU_MKE185F512VLH16 (U?.55), Header Pinout (P6.2)
C14: MCU_MKE185F512VLH16 (U?.30), Header Pinout (P5.11)
D4: MCU_MKE185F512VLH16 (P8.1 U?.44), Header Pinout (P4.13)
D15: LEDs (M?#2.1 R?#4.2), MCU_MKE185F512VLH16 (U?.15), Header Pinout (P3.10)
D16: LEDs (M?#1.1 R?#2.2), MCU_MKE185F512VLH16 (U?.14), Header Pinout (P3.11)
E4: CAN_Tranceiver (U1.4), MCU_MKE185F512VLH16 (U?.6), Header Pinout (P3.3)
E5: CAN_Tranceiver (U1.1), MCU_MKE185F512VLH16 (U?.5), Header Pinout (P3.4)
E11: MCU_MKE185F512VLH16 (P7.1 U?.3), Header Pinout (P3.6)
JTAG_RST: MCU_MKE185F512VLH16 (R?#6.1 U?.63 X?.10), Header Pinout (P6.10)
JTAG_TCLK: MCU_MKE185F512VLH16 (U?.62 X?.4), Header Pinout (P6.11)
JTAG_TDI: MCU_MKE185F512VLH16 (U?.61 X?.8), Header Pinout (P6.12)
JTAG_TDO: MCU_MKE185F512VLH16 (U?.58 X?.6), Header Pinout (P6.15)
JTAG_TMS: MCU_MKE185F512VLH16 (R?#5.1 U?.64 X?.2), Header Pinout (P6.9)
NetP3_5: MCU_MKE185F512VLH16 (U?.4), Header Pinout (P3.5)
NetP3_7: MCU_MKE185F512VLH16 (U?.2), Header Pinout (P3.7)
NetP3_8: MCU_MKE185F512VLH16 (U?.1), Header Pinout (P3.8)
NetP3_9: MCU_MKE185F512VLH16 (U?.16), Header Pinout (P3.9)
NetP3_12: MCU_MKE185F512VLH16 (U?.13), Header Pinout (P3.12)
NetP3_13: MCU_MKE185F512VLH16 (U?.12), Header Pinout (P3.13)
NetP3_14: MCU_MKE185F512VLH16 (U?.11), Header Pinout (P3.14)
NetP4_2: MCU_MKE185F512VLH16 (U?.39), Header Pinout (P4.2)
NetP4_3: MCU_MKE185F512VLH16 (U?.38), Header Pinout (P4.3)
NetP4_4: MCU_MKE185F512VLH16 (U?.37), Header Pinout (P4.4)
NetP4_5: MCU_MKE185F512VLH16 (U?.36), Header Pinout (P4.5)
NetP4_6: MCU_MKE185F512VLH16 (U?.35), Header Pinout (P4.6)
NetP4_7: MCU_MKE185F512VLH16 (U?.34), Header Pinout (P4.7)
NetP4_8: MCU_MKE185F512VLH16 (U?.33), Header Pinout (P4.8)
NetP4_11: MCU_MKE185F512VLH16 (U?.46), Header Pinout (P4.11)
NetP4_12: MCU_MKE185F512VLH16 (U?.45), Header Pinout (P4.12)
NetP4_14: MCU_MKE185F512VLH16 (U?.43), Header Pinout (P4.14)
NetP4_15: MCU_MKE185F512VLH16 (U?.42), Header Pinout (P4.15)
NetP5_1: MCU_MKE185F512VLH16 (U?.24), Header Pinout (P5.1)
NetP5_2: MCU_MKE185F512VLH16 (U?.23), Header Pinout (P5.2)
NetP5_3: MCU_MKE185F512VLH16 (U?.22), Header Pinout (P5.3)
NetP5_4: MCU_MKE185F512VLH16 (U?.21), Header Pinout (P5.4)
NetP5_5: MCU_MKE185F512VLH16 (U?.20), Header Pinout (P5.5)
NetP5_6: MCU_MKE185F512VLH16 (U?.19), Header Pinout (P5.6)
NetP5_7: MCU_MKE185F512VLH16 (U?.18), Header Pinout (P5.7)
NetP5_8: MCU_MKE185F512VLH16 (U?.17), Header Pinout (P5.8)
NetP5_9: MCU_MKE185F512VLH16 (U?.32), Header Pinout (P5.9)
NetP5_10: MCU_MKE185F512VLH16 (U?.31), Header Pinout (P5.10)
NetP5_12: MCU_MKE185F512VLH16 (U?.29), Header Pinout (P5.12)
NetP5_13: MCU_MKE185F512VLH16 (U?.28), Header Pinout (P5.13)
NetP5_14: MCU_MKE185F512VLH16 (U?.27), Header Pinout (P5.14)
NetP5_15: MCU_MKE185F512VLH16 (U?.26), Header Pinout (P5.15)
NetP5_16: MCU_MKE185F512VLH16 (U?.25), Header Pinout (P5.16)
NetP6_3: MCU_MKE185F512VLH16 (U?.54), Header Pinout (P6.3)
NetP6_4: MCU_MKE185F512VLH16 (U?.53), Header Pinout (P6.4)
NetP6_5: MCU_MKE185F512VLH16 (U?.52), Header Pinout (P6.5)
NetP6_6: MCU_MKE185F512VLH16 (U?.51), Header Pinout (P6.6)
NetP6_13: MCU_MKE185F512VLH16 (U?.60), Header Pinout (P6.13)
NetP6_14: MCU_MKE185F512VLH16 (U?.59), Header Pinout (P6.14)
NetP6_16: MCU_MKE185F512VLH16 (U?.57), Header Pinout (P6.16)